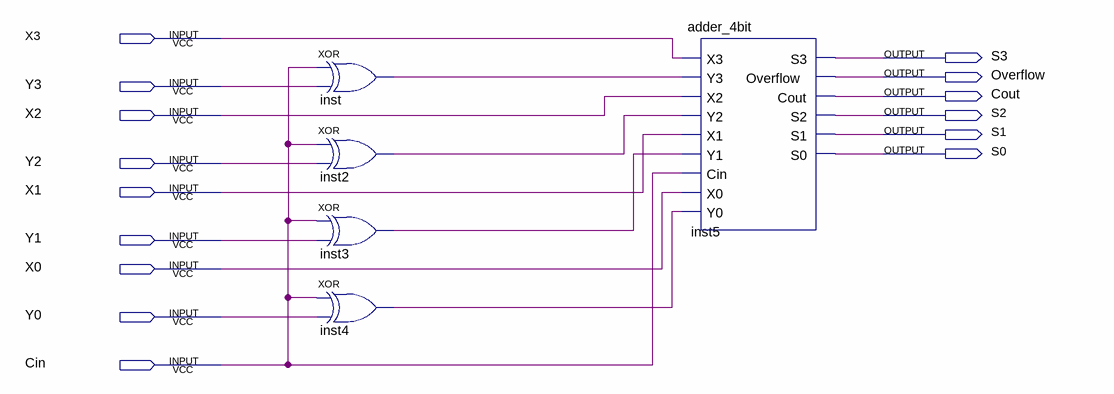
[diagram p0: schematic sheet]
// Quartus schematic add_sub.bdf as structural Verilog: 5 symbols, 15 pins
module add_sub (
  input  X3,
  input  Y3,
  input  X2,
  input  Y2,
  input  X1,
  input  Y1,
  input  X0,
  input  Y0,
  input  Cin,
  output S3,
  output Overflow,
  output Cout,
  output S2,
  output S1,
  output S0
);

  wire inst2_out, inst3_out, inst4_out, inst_out;

  xor inst (inst_out, Cin, Y3);
  xor inst2 (inst2_out, Cin, Y2);
  xor inst3 (inst3_out, Cin, Y1);
  xor inst4 (inst4_out, Cin, Y0);
  adder_4bit inst5 (
    .X3(X3), .Y3(inst_out), .X2(X2), .Y2(inst2_out), .X1(X1), .Y1(inst3_out), .Cin(Cin), .X0(X0),
    .Y0(inst4_out), .S3(S3), .Overflow(Overflow), .Cout(Cout), .S2(S2), .S1(S1), .S0(S0));
endmodule
